# Altium project Buck-Boost-Converter.PrjPcb (part 2 of 2)

## Sheet GateDriver.SchDoc
size Letter; SheetNumber: 2; SheetTotal: 3
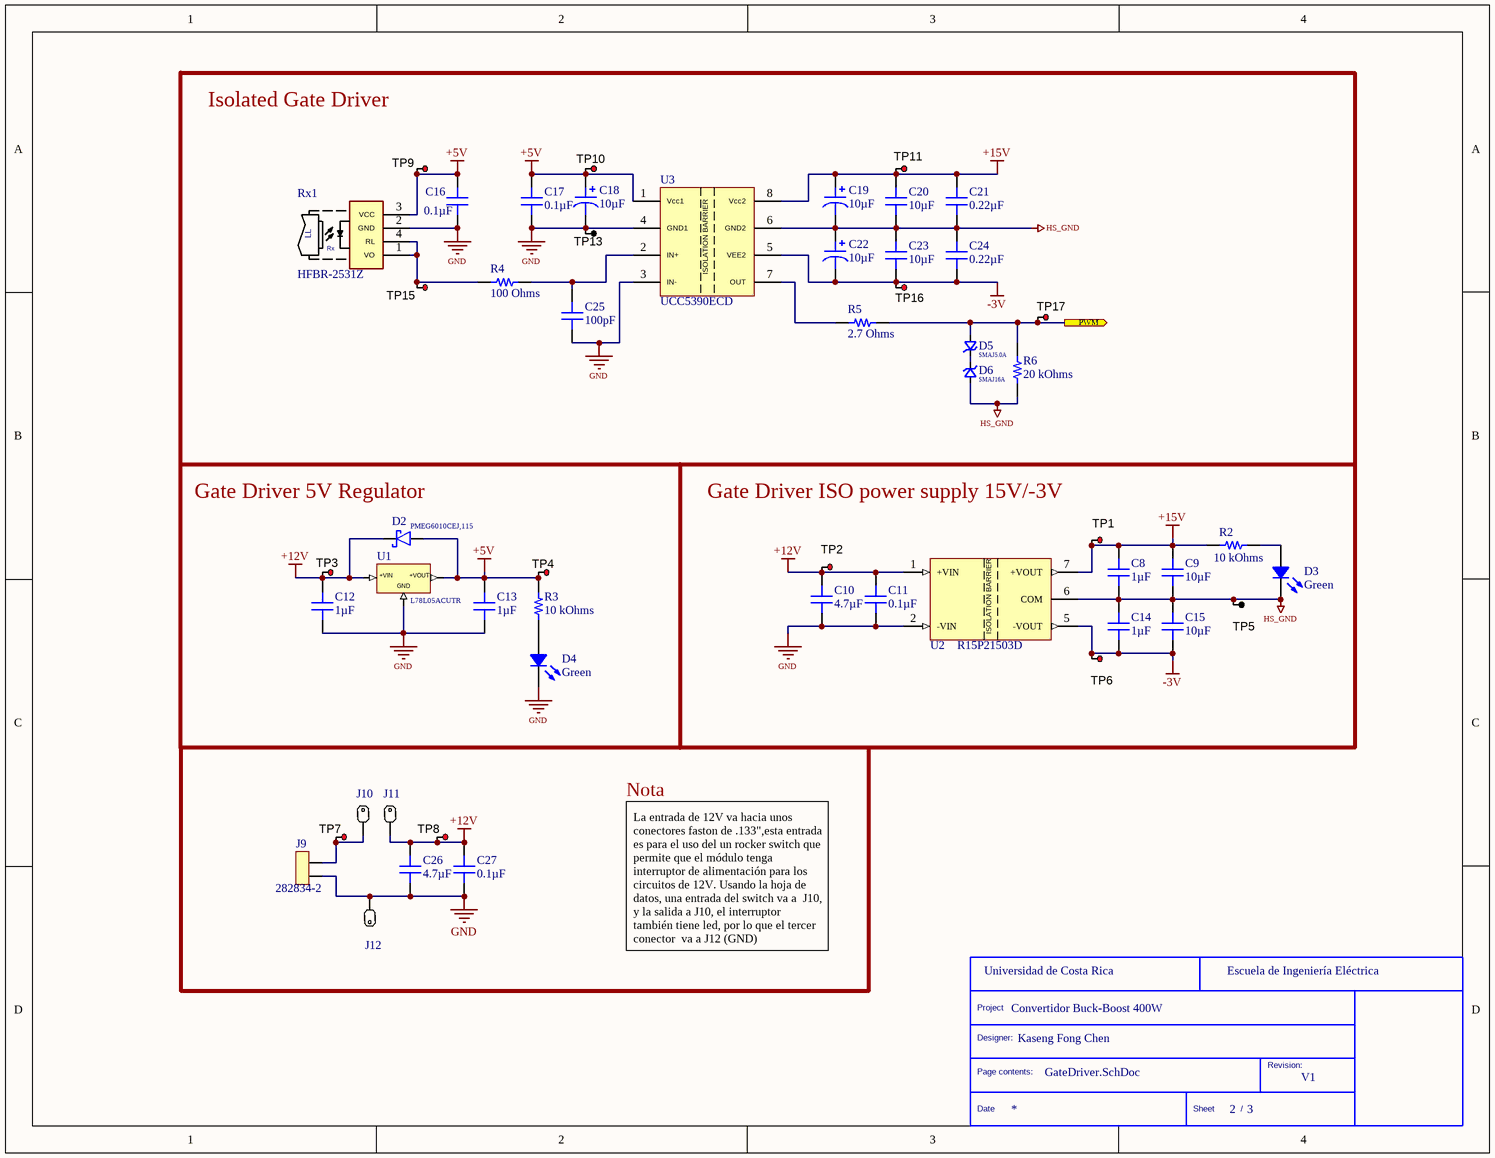
[diagram p1: GateDriver.SchDoc]

### Parts
(Parts that share a designator on the sheet are numbered #1, #2 ... from top to bottom, then left to right.)
*#2  TittleBlock  (value not drawn)  (graphical)
C8  1µF  [CAP 0603_1608]
C9  10µF  [CAP 1206_3216 - 1.8MM]
C10  4.7µF  [CAP 1206_3216 - 1.8MM]
C11  0.1µF  [CAP 0603_1608]
C12  1µF  [CAP 0603_1608]
C13  1µF  [CAP 0603_1608]
C14  1µF  [CAP 0603_1608]
C15  10µF  [CAP 1206_3216 - 1.8MM]
C16  0.1µF  [CAP 0603_1608]
C17  0.1µF  [CAP 0603_1608]
C18  10µF  [CAP POL 2917_7343]
C19  10µF  [CAP POL 2917_7343]
C20  10µF  [CAP 1210_3225 - 2.8MM]
C21  0.22µF  [CAP 0805_2012]
C22  10µF  [CAP POL 2917_7343]
C23  10µF  [CAP 1210_3225 - 2.8MM]
C24  0.22µF  [CAP 0805_2012]
C25  100pF  [CAP 0603_1608]
C26  4.7µF  [CAP 1206_3216 - 1.8MM]
C27  0.1µF  [CAP 0603_1608]
D2  PMEG6010CEJ,115  [SOD-323F]
D3  Green  [LED 0603_1608 GREEN]
D4  Green  [LED 0603_1608 GREEN]
D5  SMAJ5.0A  [DO214AC SMA]
D6  SMAJ16A  [DO214AC SMA]
J9  282834-2  [TE 282834-2]
J10  Faston .133  (value not drawn)
J11  Faston .133  (value not drawn)
J12  Faston .133  (value not drawn)
R2  10 kOhms  [RES 0603_1608]
R3  10 kOhms  [RES 0603_1608]
R4  100 Ohms  [RES 0603_1608]
R5  2.7 Ohms  [RES 1206_3216]
R6  20 kOhms  [RES 0603_1608]
Rx1  HFBR-2531Z  [HFBR-15X1V]
TP1  5010  [Keystone5010]  (value not drawn)
TP2  5010  [Keystone5010]  (value not drawn)
TP3  5010  [Keystone5010]  (value not drawn)
TP4  5010  [Keystone5010]  (value not drawn)
TP5  5011  [Keystone5011]  (value not drawn)
TP6  5010  [Keystone5010]  (value not drawn)
TP7  5010  [Keystone5010]  (value not drawn)
TP8  5010  [Keystone5010]  (value not drawn)
TP9  5010  [Keystone5010]  (value not drawn)
TP10  5010  [Keystone5010]  (value not drawn)
TP11  5010  [Keystone5010]  (value not drawn)
TP13  5011  [Keystone5011]  (value not drawn)
TP15  5010  [Keystone5010]  (value not drawn)
TP16  5010  [Keystone5010]  (value not drawn)
TP17  5010  [Keystone5010]  (value not drawn)
U1  L78L05ACUTR  [VREG_L78L12ABUTR]
U2  R15P21503D  [CONV_R15P21503D]
U3  UCC5390ECD  [SOIC127P599X175-8N]

### Ports
PWM (out)

### Nets
+5V: C13.2 C16.2 C17.2 C18.1 D2.2 R3.1 Rx1.3(VCC) TP4.1 TP9.1 TP10.1 U1.1(OUT) U3.1(Vcc1)
+12V: C10.2 C11.2 C12.2 C26.2 C27.2 D2.1 J11.1(P1) TP2.1 TP3.1 TP8.1 U1.3(IN) U2.1(+VIN)
+15V: C8.2 C9.2 C19.1 C20.1 C21.1 R2.1 TP1.1 TP11.1 U2.7(+VOUT) U3.8(Vcc2)
-3V: C14.1 C15.1 C22.2 C23.2 C24.2 TP6.1 TP16.1 U2.5(-VOUT) U3.5(VEE2)
GND: C10.1 C11.1 C12.1 C13.1 C16.1 C17.1 C18.2 C25.1 C26.1 C27.1 D4.2 J9.2 J12.1(P1) Rx1.2(GND) TP13.1 U1.2(GND) U2.2(-VIN) U3.3(IN-) U3.4(GND1)
HS_GND: C8.1 C9.1 C14.2 C15.2 C19.2 C20.2 C21.2 C22.1 C23.1 C24.1 D3.2 D6.2 R6.1 TP5.1 U2.6(COM) U3.6(GND2)
NetC25_2: C25.2 R4.2 U3.2(IN+)
NetD3_1: D3.1 R2.2
NetD4_1: D4.1 R3.2
NetD5_1: D5.1 D6.1
NetD5_2: D5.2 R5.2 R6.2 TP17.1 ; port PWM
NetJ9_1: J9.1 J10.1(P1) TP7.1
NetR4_1: R4.1 Rx1.1(VO) Rx1.4(RL) TP15.1
NetR5_1: R5.1 U3.7(OUT)

### Notes on the sheet
- Isolated Gate Driver
- (near D2) Gate Driver 5V Regulator
- Gate Driver ISO power supply 15V/-3V
- Nota
- La entrada de 12V va hacia unos conectores faston de .133",esta entrada es para el uso del un rocker switch que permite que el módulo tenga interruptor de alimentación para los circuitos de 12V. Usando la hoja de datos, una entrada del switch va a  J10, y la salida a J10, el interruptor también tiene led, por lo que el tercer conector  va a J12 (GND)
  .
- (in symbol HFBR-2531Z) LL; Rx
- (in symbol L78L05ACUTR) +VIN; +VOUT
- (in symbol R15P21503D) ISOLATION BARRIER
- (in symbol TittleBlock) Project; Designer:; Page contents:; Revision:; Date; Sheet; /
- (in symbol UCC5390ECD) ISOLATION BARRIER

### Library data of the parts
*#2 = TittleBlock: Standard Title block
C8 C14 = UMK107AB7105KA-T: CAP CER 1UF 50V X7R 0603; Manufacturer: Taiyo Yuden; Tolerance: ±10%; Part Number: UMK107AB7105KA-T; Value: 1µF; Applications: General Purpose; Capacitance: 1µF; ComponentLink1Description: Datasheet; ComponentLink1URL: https://www.yuden.co.jp/productdata/catalog/mlcc01_e.pdf; ComponentLink2Description: DigiKey Link; ComponentLink2URL: http://digikey.com/product-detail/en/taiyo-yuden/UMK107AB7105KA-T/587-3247-1-ND/3660107; Device Package: 0603 (1608 Metric); LastUpdated: 2/9/2020 01:03:17; Lifecycle Status: Active; Minimum Order: 1; Mounting Type: Surface Mount, MLCC; Operating Temperature: -55°C ~ 125°C; Package / Case: 0603 (1608 Metric); Packaging: TapeAndReel; PartId: 12796; Part Status: Active; Price: 0.05; Series: M; Size / Dimension: 0.063" L x 0.031" W (1.60mm x 0.80mm); Supplier 1: DigiKey; Supplier Part Number 1: 587-3247-1-ND; Temperature Coefficient: X7R; Thickness (Max): 0.037" (0.95mm); Voltage - Rated: 50V
C9 C15 = TMK316AB7106KL-T: CAP CER 10UF 25V X7R 1206; Manufacturer: Taiyo Yuden; Tolerance: ±10%; Part Number: TMK316AB7106KL-T; Value: 10µF; Applications: General Purpose; Capacitance: 10µF; ComponentLink1Description: Datasheet; ComponentLink1URL: https://www.yuden.co.jp/productdata/catalog/mlcc01_e.pdf; ComponentLink2Description: DigiKey Link; ComponentLink2URL: http://digikey.com/product-detail/en/taiyo-yuden/TMK316AB7106KL-T/587-3486-1-ND/4157519; Device Package: 1206 (3216 Metric); LastUpdated: 2/9/2020 01:05:40; Lifecycle Status: Active; Minimum Order: 1; Mounting Type: Surface Mount, MLCC; Operating Temperature: -55°C ~ 125°C; Package / Case: 1206 (3216 Metric); Packaging: TapeAndReel; PartId: 20052; Part Status: Active; Price: 0.08; Series: M; Size / Dimension: 0.126" L x 0.063" W (3.20mm x 1.60mm); Supplier 1: DigiKey; Supplier Part Number 1: 587-3486-1-ND; Temperature Coefficient: X7R; Thickness (Max): 0.071" (1.80mm); Voltage - Rated: 25V
C10 C26 = UMK316AB7475KL-T: CAP CER 4.7UF 50V X7R 1206; Manufacturer: Taiyo Yuden; Tolerance: ±10%; Part Number: UMK316AB7475KL-T; Value: 4.7µF; Applications: General Purpose; Capacitance: 4.7µF; ComponentLink1Description: Datasheet; ComponentLink1URL: https://www.yuden.co.jp/productdata/catalog/mlcc01_e.pdf; ComponentLink2Description: DigiKey Link; ComponentLink2URL: http://digikey.com/product-detail/en/taiyo-yuden/UMK316AB7475KL-T/587-2994-1-ND/2714187; Device Package: 1206 (3216 Metric); LastUpdated: 2/9/2020 01:05:40; Lifecycle Status: Active; Minimum Order: 1; Mounting Type: Surface Mount, MLCC; Operating Temperature: -55°C ~ 125°C; Package / Case: 1206 (3216 Metric); Packaging: TapeAndReel; PartId: 20094; Part Status: Active; Price: 0.08; Series: M; Size / Dimension: 0.126" L x 0.063" W (3.20mm x 1.60mm); Supplier 1: DigiKey; Supplier Part Number 1: 587-2994-1-ND; Temperature Coefficient: X7R; Thickness (Max): 0.071" (1.80mm); Voltage - Rated: 50V
C11 C16 C17 C27 = C0603C104M5RACTU: CAP CER 0.1UF 50V X7R 0603; Manufacturer: KEMET; Tolerance: ±20%; Part Number: C0603C104M5RACTU; Value: 0.1µF; Applications: Bypass, Decoupling; Capacitance: 0.1µF; ComponentLink1Description: Datasheet; ComponentLink1URL: https://api.kemet.com/component-edge/download/datasheet/C0603C104M5RACTU.pdf; ComponentLink2Description: DigiKey Link; ComponentLink2URL: http://digikey.com/product-detail/en/kemet/C0603C104M5RACTU/399-7845-1-ND/3471568; Device Package: 0603 (1608 Metric); LastUpdated: 2/9/2020 01:03:01; Lifecycle Status: Active; Minimum Order: 1; Mounting Type: Surface Mount, MLCC; Operating Temperature: -55°C ~ 125°C; Package / Case: 0603 (1608 Metric); Packaging: TapeAndReel; PartId: 17854; Part Status: Active; Price: 0.01; Series: SMD Comm X7R; Size / Dimension: 0.063" L x 0.031" W (1.60mm x 0.80mm); Supplier 1: DigiKey; Supplier Part Number 1: 399-7845-1-ND; Temperature Coefficient: X7R; Thickness (Max): 0.034" (0.87mm); Voltage - Rated: 50V
C12 = TMK107B7105KA-T: CAP CER 1UF 25V X7R 0603; Manufacturer: Taiyo Yuden; Tolerance: ±10%; Part Number: TMK107B7105KA-T; Value: 1µF; Applications: General Purpose; Capacitance: 1µF; ComponentLink1Description: Datasheet; ComponentLink1URL: https://www.yuden.co.jp/productdata/catalog/mlcc01_e.pdf; ComponentLink2Description: DigiKey Link; ComponentLink2URL: http://digikey.com/product-detail/en/taiyo-yuden/TMK107B7105KA-T/587-2984-1-ND/2714177; Device Package: 0603 (1608 Metric); LastUpdated: 2/9/2020 01:03:30; Lifecycle Status: Active; Minimum Order: 1; Mounting Type: Surface Mount, MLCC; Operating Temperature: -55°C ~ 125°C; Package / Case: 0603 (1608 Metric); Packaging: TapeAndReel; PartId: 5586; Part Status: Active; Price: 0.01; Series: M; Size / Dimension: 0.063" L x 0.031" W (1.60mm x 0.80mm); Supplier 1: DigiKey; Supplier Part Number 1: 587-2984-1-ND; Temperature Coefficient: X7R; Thickness (Max): 0.035" (0.90mm); Voltage - Rated: 25V
C13 = CC0603KRX7R7BB105: CAP CER 1UF 16V X7R 0603; Manufacturer: Yageo; Tolerance: ±10%; Part Number: CC0603KRX7R7BB105; Value: 1µF; Applications: General Purpose; Capacitance: 1µF; ComponentLink1Description: Datasheet; ComponentLink1URL: https://www.yageo.com/upload/media/product/productsearch/datasheet/mlcc/UPY-GPHC_X7R_6.3V-to-50V_18.pdf; ComponentLink2Description: DigiKey Link; ComponentLink2URL: http://digikey.com/product-detail/en/yageo/CC0603KRX7R7BB105/311-1446-1-ND/2833752; Device Package: 0603 (1608 Metric); LastUpdated: 2/9/2020 01:03:31; Lifecycle Status: Active; Minimum Order: 1; Mounting Type: Surface Mount, MLCC; Operating Temperature: -55°C ~ 125°C; Package / Case: 0603 (1608 Metric); Packaging: TapeAndReel; PartId: 5233; Part Status: Active; Price: 0.01; Series: CC; Size / Dimension: 0.063" L x 0.031" W (1.60mm x 0.80mm); Supplier 1: DigiKey; Supplier Part Number 1: 311-1446-1-ND; Temperature Coefficient: X7R; Thickness (Max): 0.035" (0.90mm); Voltage - Rated: 16V
C18 C19 C22 = T491D106K050AT: CAP TANT 10UF 10% 50V 2917; Manufacturer: KEMET; Manufacturer Size Code: D; ESR (Equivalent Series Resistance): 800mOhm; Lifetime @ Temp.: 2000 Hrs @ 125°C; Type: Molded; Part Number: T491D106K050AT; Value: 10µF; Capacitance: 10µF; ComponentLink1Description: Datasheet; ComponentLink1URL: https://api.kemet.com/component-edge/download/datasheet/T491D106K050AT.pdf; ComponentLink2Description: DigiKey Link; ComponentLink2URL: http://digikey.com/product-detail/en/kemet/T491D106K050AT/399-8361-1-ND/3472084; Device Package: 2917 (7343 Metric); Features: General Purpose; Height - Seated (Max): 0.122" (3.10mm); LastUpdated: 2/9/2020 01:16:12; Lifecycle Status: Active; Minimum Order: 1; Mounting Type: Surface Mount; Operating Temperature: -55°C ~ 125°C; Package / Case: 2917 (7343 Metric); Packaging: TapeAndReel; PartId: 3121; Part Status: Active; Price: 0.86; Series: T491; Size / Dimension: 0.287" L x 0.169" W (7.30mm x 4.30mm); Supplier 1: DigiKey; Supplier Part Number 1: 399-8361-1-ND; Tolerance: ±10%; Voltage - Rated: 50V
C20 C23 = UMK325C7106MM-T: CAP CER 10UF 50V X7S 1210; Manufacturer: Taiyo Yuden; Tolerance: ±20%; Part Number: UMK325C7106MM-T; Value: 10µF; Applications: General Purpose; Capacitance: 10µF; ComponentLink1Description: Datasheet; ComponentLink1URL: //media.digikey.com/pdf/Data%20Sheets/Taiyo%20Yuden%20PDFs%20URL%20links/UMK325C7106MM-T.pdf; ComponentLink2Description: DigiKey Link; ComponentLink2URL: http://digikey.com/product-detail/en/taiyo-yuden/UMK325C7106MM-T/587-1818-1-ND/1465288; Device Package: 1210 (3225 Metric); LastUpdated: 2/9/2020 01:10:51; Lifecycle Status: Active; Minimum Order: 1; Mounting Type: Surface Mount, MLCC; Operating Temperature: -55°C ~ 125°C; Package / Case: 1210 (3225 Metric); Packaging: TapeAndReel; PartId: 23921; Part Status: Active; Price: 0.21; Series: M; Size / Dimension: 0.126" L x 0.098" W (3.20mm x 2.50mm); Supplier 1: DigiKey; Supplier Part Number 1: 587-1818-1-ND; Temperature Coefficient: X7S; Thickness (Max): 0.106" (2.70mm); Voltage - Rated: 50V
C21 C24 = UMK212B7224KG-T: CAP CER 0.22UF 50V X7R 0805; Manufacturer: Taiyo Yuden; Tolerance: ±10%; Part Number: UMK212B7224KG-T; Value: 0.22µF; Applications: General Purpose; Capacitance: 0.22µF; ComponentLink1Description: Datasheet; ComponentLink1URL: https://www.yuden.co.jp/productdata/catalog/mlcc01_e.pdf; ComponentLink2Description: DigiKey Link; ComponentLink2URL: http://digikey.com/product-detail/en/taiyo-yuden/UMK212B7224KG-T/587-1287-1-ND/931064; Device Package: 0805 (2012 Metric); LastUpdated: 2/9/2020 01:04:19; Lifecycle Status: Active; Minimum Order: 1; Mounting Type: Surface Mount, MLCC; Operating Temperature: -55°C ~ 125°C; Package / Case: 0805 (2012 Metric); Packaging: TapeAndReel; PartId: 14273; Part Status: Active; Price: 0.03; Series: M; Size / Dimension: 0.079" L x 0.049" W (2.00mm x 1.25mm); Supplier 1: DigiKey; Supplier Part Number 1: 587-1287-1-ND; Temperature Coefficient: X7R; Thickness (Max): 0.053" (1.35mm); Voltage - Rated: 50V
C25 = 06035A101FAT2A: CAP CER 100PF 50V C0G/NP0 0603; Manufacturer: AVX Corporation; Temperature Coefficient: C0G, NP0; Tolerance: ±1%; Part Number: 06035A101FAT2A; Value: 100pF; Applications: General Purpose; Capacitance: 100pF; ComponentLink1Description: Datasheet; ComponentLink1URL: http://datasheets.avx.com/C0GNP0-Dielectric.pdf; ComponentLink2Description: DigiKey Link; ComponentLink2URL: http://digikey.com/product-detail/en/avx-corporation/06035A101FAT2A/478-6202-1-ND/2391401; Device Package: 0603 (1608 Metric); LastUpdated: 2/9/2020 01:03:14; Lifecycle Status: Active; Minimum Order: 1; Mounting Type: Surface Mount, MLCC; Operating Temperature: -55°C ~ 125°C; Package / Case: 0603 (1608 Metric); Packaging: TapeAndReel; PartId: 14099; Part Status: Active; Price: 0.03; Series: -; Size / Dimension: 0.063" L x 0.032" W (1.60mm x 0.81mm); Supplier 1: DigiKey; Supplier Part Number 1: 478-6202-1-ND; Thickness (Max): 0.035" (0.90mm); Voltage - Rated: 50V
D2 = PMEG6010CEJ,115: PMEG6010CEH; PMEG6010CEJ - 1 A very low VF MEGA Schottky barrier rectifiers; Manufacturer: Nexperia; =Value: 60V; Supplier 1: Digi-Key; Supplier Part Number 1: 1727-3882-1-ND; Manufacturer Part Number: PMEG6010CEJ,115; RoHS: Yes; Category: Rectifier Diodes; Stock 1: 105369; Pricing 1: 1=0,35000, 10=0,27200, 100=0,16340, 500=0,15128, 1000=0,10288 (USD); ComponentLink1URL: https://www.mouser.com/ds/2/302/PMEG6010CEH_PMEG6010CEJ-102368.pdf?src-supplier=Mouser; ComponentLink1Description: https://www.mouser.com/ds/2/302/PMEG6010CEH_PMEG6010CEJ-102368.pdf?src-supplier=Mouser; ComponentLink2URL: http://www.farnell.com/datasheets/109684.pdf?src-supplier=Farnell; ComponentLink2Description: http://www.farnell.com/datasheets/109684.pdf?src-supplier=Farnell; ComponentLink3URL: http://www.farnell.com/datasheets/109684.pdf?src-supplier=Newark; ComponentLink3Description: http://www.farnell.com/datasheets/109684.pdf?src-supplier=Newark; ComponentLink4URL: https://assets.nexperia.com/documents/data-sheet/PMEG6010CEH_PMEG6010CEJ.pdf?src-supplier=Digi-Key; ComponentLink4Description: https://assets.nexperia.com/documents/data-sheet/PMEG6010CEH_PMEG6010CEJ.pdf?src-supplier=Digi-Key
D3 D4 = 150060GS75000: LED GREEN CLEAR 0603 SMD; Manufacturer: Würth Elektronik; Configuration: Standard; Current - Test: 20mA; Lens Color: Colorless; Lens Size: 1.10mm x 0.70mm; Lens Style: Rectangle with Flat Top; Millicandela Rating: 430mcd; Viewing Angle: 140°; Voltage - Forward (Vf) (Typ): 3.2V; Wavelength - Dominant: 520nm; Wavelength - Peak: 515nm; Part Number: 150060GS75000; Color: Green; ComponentLink1Description: Datasheet; ComponentLink1URL: https://katalog.we-online.de/led/datasheet/150060GS75000.pdf; ComponentLink2Description: DigiKey Link; ComponentLink2URL: http://digikey.com/product-detail/en/w-rth-elektronik/150060GS75000/732-4971-1-ND/4489896; Device Package: 0603 (1608 Metric); Height (Max): 0.80mm; LastUpdated: 2/9/2020 01:20:41; Lens Transparency: Clear; Lifecycle Status: Active; Minimum Order: 1; Mounting Type: Surface Mount; Package / Case: 0603 (1608 Metric); Packaging: TapeAndReel; PartId: 686; Part Status: Active; Price: 0.10; Series: WL-SMCW; Size / Dimension: 1.60mm L x 0.80mm W; Supplier 1: DigiKey; Supplier Part Number 1: 732-4971-1-ND; Supplier Device Package: 0603; Value: Green
D5 = SMAJ5.0A: BOURNS - SMAJ5.0A - TVS Diode, SMAJ Series, Unidirectional, 5 V, 9.2 V, DO-214AC (SMA), 2 Pins; Max Power Dissipation: 400W; Number of Elements: 1; Max Surge Current: 40A; Reverse Breakdown Voltage: 6.4V; Breakdown Voltage: 7V; Reverse Standoff Voltage: 5V; Clamping Voltage: 9.2V; Test Current: 10mA; Peak Pulse Current: 43.5A; Element Configuration: Single; Leakage Current: 800uA; Operating Supply Voltage: 3.5V; Power Line Protection: No; Diode Type: ZENER; ESD Protection: Yes; Supplier 1: Digi-Key; Supplier Part Number 1: SMAJ5.0ABCT-ND; Manufacturer: Bourns; Manufacturer Part Number: SMAJ5.0A; RoHS: Yes; Category: TVS Diodes; Stock 1: 30981; Pricing 1: 1=0,49000, 10=0,34300, 100=0,17320, 500=0,14130, 1000=0,10483, 2000=0,08820 (USD); Mount: Surface Mount; Case/Package: DO-214AC; Number of Pins: 2; Min Operating Temperature: -55°C; Max Operating Temperature: 150°C; Packaging: Tape and Reel; Package Quantity: 1; Series: SMAJ; Polarity: Unidirectional; Direction: Unidirectional; Peak Pulse Power: 400W; Min Breakdown Voltage: 6.4V; Number of Channels: 1; Max Reverse Leakage Current: 800uA; Termination: SMD/SMT; Max Breakdown Voltage: 7V; Number of Unidirectional Channels: 1; Resistor Type: Zener; Length: 4.57mm; Width: 2.92mm; Height: 2.42mm; Radiation Hardening: No; RoHS Compliant: Yes; REACH SVHC: No SVHC; ComponentLink1URL: https://datasheet.ciiva.com/25624/0900766b8112213b-25624680.pdf?src-supplier=RSComponents; ComponentLink1Description: https://datasheet.ciiva.com/25624/0900766b8112213b-25624680.pdf?src-supplier=RSComponents; ComponentLink2URL: https://datasheet.ciiva.com/333/smaj-333521.pdf?src-supplier=Digi-Key; ComponentLink2Description: https://datasheet.ciiva.com/333/smaj-333521.pdf?src-supplier=Digi-Key; ComponentLink3URL: https://datasheet.ciiva.com/333/smaj-333522.pdf?src-supplier=Digi-Key; ComponentLink3Description: https://datasheet.ciiva.com/333/smaj-333522.pdf?src-supplier=Digi-Key; ComponentLink4URL: https://datasheet.ciiva.com/333/smaj-333523.pdf?src-supplier=Digi-Key; ComponentLink4Description: https://datasheet.ciiva.com/333/smaj-333523.pdf?src-supplier=Digi-Key; ComponentLink5URL: https://datasheet.ciiva.com/3021/smaj-3021400.pdf?src-supplier=Avnet; ComponentLink5Description: https://datasheet.ciiva.com/3021/smaj-3021400.pdf?src-supplier=Avnet; ComponentLink6URL: https://datasheet.ciiva.com/30169/smaj-30169929.pdf?src-supplier=Onlinecomponents.com; ComponentLink6Description: https://datasheet.ciiva.com/30169/smaj-30169929.pdf?src-supplier=Onlinecomponents.com; ComponentLink7URL: https://datasheet.ciiva.com/28409/1695388-28409916.pdf?src-supplier=Element14; ComponentLink7Description: https://datasheet.ciiva.com/28409/1695388-28409916.pdf?src-supplier=Element14
D6 = SMAJ16A: TVS DIODE 16VWM 26VC DO214AC; Manufacturer: Bourns; Clamping Voltage: 26V; Peak Pulse Power: 400W; Reverse Standoff Voltage: 16V; Peak Pulse Current: 15.3A; Polarity: Unidirectional; Test Current: 1mA; Min Breakdown Voltage: 17.8V; Max Surge Current: 40A; Breakdown Voltage: 19.7V; Operating Supply Voltage: 3.5V; Number of Channels: 1; Leakage Current: 5uA; Element Configuration: Single; Power Line Protection: No; Diode Type: ZENER; Supplier 1: Digi-Key; Supplier Part Number 1: SMAJ16ABCT-ND; Manufacturer Part Number: SMAJ16A; RoHS: Yes; Category: TVS Diodes; Stock 1: 14121; Pricing 1: 1=0,49000, 10=0,34400, 100=0,17360, 500=0,14160, 1000=0,10505, 2000=0,08838 (USD); Mount: Surface Mount; Case/Package: DO-214AC; Number of Pins: 2; Min Operating Temperature: -55°C; Max Operating Temperature: 150°C; Packaging: Tape and Reel; Package Quantity: 1; Direction: Unidirectional; Reverse Breakdown Voltage: 17.8V; Number of Elements: 1; Termination: SMD/SMT; Max Reverse Leakage Current: 5uA; Number of Unidirectional Channels: 1; Series: SMAJ; Max Power Dissipation: 400W; Resistor Type: Zener; Max Breakdown Voltage: 19.7V; Radiation Hardening: No; RoHS Compliant: Yes; REACH SVHC: No SVHC; ComponentLink1URL: https://datasheet.ciiva.com/3022/smaj-3022194.pdf?src-supplier=Avnet; ComponentLink1Description: https://datasheet.ciiva.com/3022/smaj-3022194.pdf?src-supplier=Avnet; ComponentLink2URL: https://datasheet.ciiva.com/3022/smaj-3022195.pdf?src-supplier=Avnet; ComponentLink2Description: https://datasheet.ciiva.com/3022/smaj-3022195.pdf?src-supplier=Avnet; ComponentLink3URL: https://datasheet.ciiva.com/8031/1695388-8031131.pdf?src-supplier=Element14; ComponentLink3Description: https://datasheet.ciiva.com/8031/1695388-8031131.pdf?src-supplier=Element14; ComponentLink4URL: https://datasheet.ciiva.com/28649/1695388-28649163.pdf?src-supplier=Element14; ComponentLink4Description: https://datasheet.ciiva.com/28649/1695388-28649163.pdf?src-supplier=Element14; ComponentLink5URL: https://datasheet.ciiva.com/333/smaj-333452.pdf?src-supplier=Digi-Key; ComponentLink5Description: https://datasheet.ciiva.com/333/smaj-333452.pdf?src-supplier=Digi-Key; ComponentLink6URL: https://datasheet.ciiva.com/333/smaj-333453.pdf?src-supplier=Digi-Key; ComponentLink6Description: https://datasheet.ciiva.com/333/smaj-333453.pdf?src-supplier=Digi-Key; ComponentLink7URL: https://datasheet.ciiva.com/17413/smaj-17413677.pdf?src-supplier=Avnet+Europe; ComponentLink7Description: https://datasheet.ciiva.com/17413/smaj-17413677.pdf?src-supplier=Avnet+Europe; ComponentLink8URL: https://datasheet.ciiva.com/333/smaj-333454.pdf?src-supplier=Digi-Key; ComponentLink8Description: https://datasheet.ciiva.com/333/smaj-333454.pdf?src-supplier=Digi-Key; ComponentLink9URL: https://datasheet.ciiva.com/16237/smaj-16237406.pdf?src-supplier=Onlinecomponents.com; ComponentLink9Description: https://datasheet.ciiva.com/16237/smaj-16237406.pdf?src-supplier=Onlinecomponents.com
J9 = 282834-2: TE CONNECTIVITY / BUCHANAN - 282834-2 - TERMINAL BLOCK, WIRE TO BRD, 2POS, 16AWG; Plating: Brass,Steel; Number of Contacts: 2; Voltage Rating: 150V; Number of Levels: 1; Current: 10A; Connector Type: Receptacle; Interlock: No (Without); Screwless Terminal Block: Yes (With); Gender: Male; Pitch: 2.54mm; Wire Gauge (Max): 30AWG; Thread Size: M1.6; Tail Length: 3.4mm; Approvals: UL; Supplier 1: Digi-Key; Supplier Part Number 1: A98333-ND; Manufacturer: TE Connectivity; Manufacturer Part Number: 282834-2; RoHS: Yes; Category: Terminal Blocks; Stock 1: 21575; Pricing 1: 1=1,27000, 10=0,89500, 25=0,83440, 50=0,75740, 100=0,75410, 250=0,63676, 500=0,60324, 1000=0,53622, 5000=0,50270 (USD); Mount: Through Hole; Housing Color: Green; Contact Plating: Tin; Contact Material: Brass; Color: Green; Housing Material: Polyamide; Material: Nylon; Min Operating Temperature: -40°C; Max Operating Temperature: 105°C; Number of Rows: 1; Termination: Solder; Orientation: Straight; Package Quantity: 300; Packaging: Bulk; Number of Positions: 2; Number of Positions Per Level: 2; Voltage: 150V; Max Supply Voltage (AC): 150V; Number of Circuits: 2; Screw Flange: No (Without); Side Stackable: Yes (With); Series: Buchanan; Max Voltage Rating (AC): 150V; Current Rating: 10A; Closed End: No (Without); Max Current Rating: 10A; Number of Poles: 2; Length: 5.54mm; Width: 6.5mm; Wire Gauge (Min): 30AWG; Depth: 6.5mm; Wire/Cable Gauge: 30AWG; Radiation Hardening: No; ELV: Compliant; Flammability Rating: UL94 V-0; RoHS Compliant: Yes; Lead Free: Lead Free; REACH SVHC: Unknown; ComponentLink1URL: https://datasheet.ciiva.com/11758/0900766b80e7dc96-11758675.pdf?src-supplier=RSComponents; ComponentLink1Description: https://datasheet.ciiva.com/11758/0900766b80e7dc96-11758675.pdf?src-supplier=RSComponents; ComponentLink2URL: https://datasheet.ciiva.com/16386/282834-2-16386363.pdf?src-supplier=Future+Electronics; ComponentLink2Description: https://datasheet.ciiva.com/16386/282834-2-16386363.pdf?src-supplier=Future+Electronics; ComponentLink3URL: https://datasheet.ciiva.com/14609/70086732-14609670.pdf?src-supplier=Allied+Electronics; ComponentLink3Description: https://datasheet.ciiva.com/14609/70086732-14609670.pdf?src-supplier=Allied+Electronics; ComponentLink4URL: https://datasheet.ciiva.com/15169/getdatasheetpartid-155864-15169558.pdf?src-supplier=Verical; ComponentLink4Description: https://datasheet.ciiva.com/15169/getdatasheetpartid-155864-15169558.pdf?src-supplier=Verical; ComponentLink5URL: https://datasheet.ciiva.com/16676/eng-cs-1308389-eurostyle-terminal-blocks-0607-16676126.pdf?src-supplier=Avnet+Europe; ComponentLink5Description: https://datasheet.ciiva.com/16676/eng-cs-1308389-eurostyle-terminal-blocks-0607-16676126.pdf?src-supplier=Avnet+Europe; ComponentLink6URL: https://datasheet.ciiva.com/30166/eng-cs-1308389-eurostyle-terminal-blocks-0607-30166974.pdf?src-supplier=Onlinecomponents.com; ComponentLink6Description: https://datasheet.ciiva.com/30166/eng-cs-1308389-eurostyle-terminal-blocks-0607-30166974.pdf?src-supplier=Onlinecomponents.com; ComponentLink7URL: https://datasheet.ciiva.com/3141/eng-cs-1308389-eurostyle-terminal-blocks-0607-3141115.pdf?src-supplier=Avnet; ComponentLink7Description: https://datasheet.ciiva.com/3141/eng-cs-1308389-eurostyle-terminal-blocks-0607-3141115.pdf?src-supplier=Avnet; ComponentLink8URL: https://datasheet.ciiva.com/823/eng-cd-282834-c1-823453.pdf?src-supplier=Digi-Key; ComponentLink8Description: https://datasheet.ciiva.com/823/eng-cd-282834-c1-823453.pdf?src-supplier=Digi-Key
J10-J12 = 1217133-1: CONN QC TAB 0.187 SOLDER; Manufacturer: TE Connectivity; Plating: Tin; Body Material: Brass; Insulation: Non-Insulated; Insulated Wire Support: Yes; Gender: Male; Outside Diameter: 1.32mm; Mating Tab Width: 4.75mm; Hole Diameter: 0.052inch; PCB Thickness: 0.062inch; Tab Width: 0.187inch; Tab Thickness: 0.032inch; Board Thickness: 1.57mm; Supplier 1: Digi-Key; Supplier Part Number 1: A100449CT-ND; Manufacturer Part Number: 1217133-1; RoHS: Yes; Category: Terminals; Stock 1: 9496; Pricing 1: 1=0,14000, 10=0,13300, 25=0,09920, 50=0,08500, 100=0,08210, 250=0,07076, 500=0,06794, 1000=0,05945, 2500=0,05379 (USD); Material: Brass; Body Plating: Tin; Contact Plating: Tin; Contact Material: Brass; Termination: Tab; Packaging: Tape and Reel; Package Quantity: 10000; Length: 12.45mm; Depth: 7.92mm; Radiation Hardening: No; Lead Free: Lead Free; ELV: Compliant; ComponentLink1URL: https://datasheet.ciiva.com/3144/eng-cs-82004-faston-pcb-tabs-receptacles-1012-3144672.pdf?src-supplier=Avnet; ComponentLink1Description: https://datasheet.ciiva.com/3144/eng-cs-82004-faston-pcb-tabs-receptacles-1012-3144672.pdf?src-supplier=Avnet; ComponentLink2URL: https://datasheet.ciiva.com/16301/eng-cs-82004-faston-pcb-tabs-receptacles-0311-16301555.pdf?src-supplier=Future+Electronics; ComponentLink2Description: https://datasheet.ciiva.com/16301/eng-cs-82004-faston-pcb-tabs-receptacles-0311-16301555.pdf?src-supplier=Future+Electronics; ComponentLink3URL: https://datasheet.ciiva.com/839/eng-cd-1217133-g-basefilename-839190.pdf?src-supplier=Digi-Key; ComponentLink3Description: https://datasheet.ciiva.com/839/eng-cd-1217133-g-basefilename-839190.pdf?src-supplier=Digi-Key; ComponentLink4URL: https://datasheet.ciiva.com/30183/eng-cat-82004-0706-042-052-30183301.pdf?src-supplier=Onlinecomponents.com; ComponentLink4Description: https://datasheet.ciiva.com/30183/eng-cat-82004-0706-042-052-30183301.pdf?src-supplier=Onlinecomponents.com; ComponentLink5URL: https://datasheet.ciiva.com/16647/eng-cs-82004-faston-pcb-tabs-receptacles-1012-16647017.pdf?src-supplier=Avnet+Europe; ComponentLink5Description: https://datasheet.ciiva.com/16647/eng-cs-82004-faston-pcb-tabs-receptacles-1012-16647017.pdf?src-supplier=Avnet+Europe; ComponentLink6URL: https://datasheet.ciiva.com/839/eng-cd-1217133-g-basefilename-839191.pdf?src-supplier=Digi-Key; ComponentLink6Description: https://datasheet.ciiva.com/839/eng-cd-1217133-g-basefilename-839191.pdf?src-supplier=Digi-Key
R2 R3 = RC0603FR-0710KL: RES SMD 10K OHM 1% 1/10W 0603; Manufacturer: Yageo; Power (Watts): 0.1W, 1/10W; Temperature Coefficient: ±100ppm/°C; Part Number: RC0603FR-0710KL; Value: 10 kOhms; ComponentLink1Description: Datasheet; ComponentLink1URL: https://www.yageo.com/upload/media/product/productsearch/datasheet/rchip/PYu-RC_Group_51_RoHS_L_10.pdf; ComponentLink2Description: DigiKey Link; ComponentLink2URL: http://digikey.com/product-detail/en/yageo/RC0603FR-0710KL/311-10.0KHRCT-ND/729827; Composition: Thick Film; Device Package: 0603 (1608 Metric); Features: Moisture Resistant; Height - Seated (Max): 0.022" (0.55mm); LastUpdated: 2/9/2020 01:09:45; Lifecycle Status: Active; Minimum Order: 1; Number of Terminations: 2; Operating Temperature: -55°C ~ 155°C; Package / Case: 0603 (1608 Metric); Packaging: CutTape; PartId: 22599; Part Status: Active; Price: 0.10; Resistance: 10 kOhms; Series: RC; Size / Dimension: 0.063" L x 0.031" W (1.60mm x 0.80mm); Supplier 1: DigiKey; Supplier Part Number 1: 311-10.0KHRCT-ND; Supplier Device Package: 0603; Tolerance: ±1%
R4 = CRCW0603100RFKEAC: RES SMD 100 OHM 1% 1/10W 0603; Manufacturer: Vishay Dale; Power (Watts): 0.1W, 1/10W; Temperature Coefficient: ±100ppm/°C; Part Number: CRCW0603100RFKEAC; Value: 100 Ohms; ComponentLink1Description: Datasheet; ComponentLink1URL: http://www.vishay.com/docs/28773/crcwce3.pdf; ComponentLink2Description: DigiKey Link; ComponentLink2URL: http://digikey.com/product-detail/en/vishay-dale/CRCW0603100RFKEAC/541-3951-1-ND/7928634; Composition: Thick Film; Device Package: 0603 (1608 Metric); Height - Seated (Max): 0.022" (0.55mm); LastUpdated: 2/9/2020 01:10:09; Lifecycle Status: Active; Minimum Order: 1; Number of Terminations: 2; Operating Temperature: -55°C ~ 155°C; Package / Case: 0603 (1608 Metric); Packaging: CutTape; PartId: 12546; Part Status: Active; Price: 0.10; Resistance: 100 Ohms; Series: CRCW-C; Supplier 1: DigiKey; Supplier Part Number 1: 541-3951-1-ND; Supplier Device Package: 0603; Tolerance: ±1%
R5 = CRCW12062R70FKEAHP: RES SMD 2.7 OHM 1% 3/4W 1206; Manufacturer: Vishay Dale; Power (Watts): 0.75W, 3/4W; Temperature Coefficient: ±100ppm/°C; Part Number: CRCW12062R70FKEAHP; ComponentLink1Description: Datasheet; ComponentLink1URL: http://www.vishay.com/docs/20043/crcwhpe3.pdf; ComponentLink2Description: DigiKey Link; ComponentLink2URL: http://digikey.com/product-detail/en/vishay-dale/CRCW12062R70FKEAHP/541-2.70UCT-ND/5326978; Composition: Thick Film; Device Package: 1206 (3216 Metric); Features: Automotive AEC-Q200, Pulse Withstanding; Height - Seated (Max): 0.024" (0.60mm); LastUpdated: 2/9/2020 01:12:48; Lifecycle Status: Active; Minimum Order: 1; Number of Terminations: 2; Operating Temperature: -55°C ~ 155°C; Package / Case: 1206 (3216 Metric); Packaging: TapeAndReel; PartId: 36112; Part Status: Active; Price: 0.06; Ratings: AEC-Q200; Resistance: 2.7 Ohms; Series: CRCW-HP; Size / Dimension: 0.122" L x 0.063" W (3.10mm x 1.60mm); Supplier 1: DigiKey; Supplier Part Number 1: 541-2.70UCT-ND; Supplier Device Package: 1206; Tolerance: ±1%; Value: 2.7 Ohms
R6 = RC0603FR-0720KL: RES SMD 20K OHM 1% 1/10W 0603; Manufacturer: Yageo; Power (Watts): 0.1W, 1/10W; Temperature Coefficient: ±100ppm/°C; Part Number: RC0603FR-0720KL; Value: 20 kOhms; ComponentLink1Description: Datasheet; ComponentLink1URL: https://www.yageo.com/upload/media/product/productsearch/datasheet/rchip/PYu-RC_Group_51_RoHS_L_10.pdf; ComponentLink2Description: DigiKey Link; ComponentLink2URL: http://digikey.com/product-detail/en/yageo/RC0603FR-0720KL/311-20.0KHRCT-ND/729987; Composition: Thick Film; Device Package: 0603 (1608 Metric); Features: Moisture Resistant; Height - Seated (Max): 0.022" (0.55mm); LastUpdated: 2/9/2020 01:09:40; Lifecycle Status: Active; Minimum Order: 1; Number of Terminations: 2; Operating Temperature: -55°C ~ 155°C; Package / Case: 0603 (1608 Metric); Packaging: CutTape; PartId: 23954; Part Status: Active; Price: 0.10; Resistance: 20 kOhms; Series: RC; Size / Dimension: 0.063" L x 0.031" W (1.60mm x 0.80mm); Supplier 1: DigiKey; Supplier Part Number 1: 311-20.0KHRCT-ND; Supplier Device Package: 0603; Tolerance: ±1%
Rx1 = HFBR-2531Z: RX Optical Fiber 5MBd 6-Pin; Manufacturer: Broadcom Avago; Wavelength: 660nm; Operating Supply Current: 10mA; Max Supply Voltage: 7V; Min Supply Voltage: -500mV; Output Current: 25mA; Data Rate: 115Kbps; Operating Supply Voltage: 5V; Max Power Dissipation: 40mW; Rise Time: 80ns; Fall Time: 40ns; Supplier 1: Digi-Key; Supplier Part Number 1: 516-2067-ND; Manufacturer Part Number: HFBR-2531Z; RoHS: Yes; Category: Fiber Optics; Stock 1: 6696; Pricing 1: 1=12,98000, 10=9,79400, 100=8,22730, 500=7,55568, 1000=7,39200 (USD); Mount: Through Hole; Number of Pins: 6; Weight: 0.021164oz; Min Operating Temperature: -40°C; Max Operating Temperature: 85°C; Package Quantity: 200; Max Output Current: 25mA; Packaging: Rail/Tube; Series: HFBR-2; Length: 18.3mm; Width: 12.2mm; Height: 18.8mm; Radiation Hardening: No; REACH SVHC: No SVHC; Lead Free: Lead Free; RoHS Compliant: Yes
TP1-TP4 TP6-TP11 TP15-TP17 = 5010: Test Point, Multipurpose, Red, TH; Manufacturer: Keystone; CompType: Test Point Loop; ContactFinish: Silver; SymbolVersion: 2008-04-04; PartNumber: 5010; PackageReference: Red Multipurpose Testpoint; RoHS: Y; MountType: TH; ComponentLink1Description: Datasheet URL; ComponentLink1URL: http://www.keyelco.com/userAssets/file/M60-2p60.pdf; Color: Red; Publisher: Texas Instruments; LatestRevisionDate: 2016-02-11; Supplier 1: Digi-Key; Supplier Part Number 1: 36-5010-ND; Supplier 2: Mouser; Supplier Part Number 2: 534-5010
TP5 TP13 = 5011: Test Point, Multipurpose, Black, TH; Manufacturer: Keystone; CompType: Test Point Loop; ContactFinish: Silver; SymbolVersion: 2008-04-04; PartNumber: 5011; PackageReference: Black Multipurpose Testpoint; RoHS: Y; MountType: TH; ComponentLink1Description: Datasheet URL; ComponentLink1URL: http://www.keyelco.com/userAssets/file/M60-2p60.pdf; Color: Black; Publisher: Texas Instruments; LatestRevisionDate: 2016-02-11; Supplier 1: Digi-Key; Supplier Part Number 1: 36-5011-ND; Supplier 2: Mouser; Supplier Part Number 2: 534-5011
U1 = L78L05ACUTR: Voltage regulator; linear, fixed; 5V; 0.1A; SOT89; SMD; 0÷125°C; Manufacturer: STMicroelectronics; Number of Outputs: 1; Max Input Voltage: 30V; Max Output Current: 100mA; Polarity: Positive; Quiescent Current: 6mA; Accuracy: 4%; Dropout Voltage: 1.7V; Min Input Voltage: 7V; Power Supply Rejection Ratio (PSRR): 49dB; Supplier 1: Digi-Key; Supplier Part Number 1: 497-1183-1-ND; Manufacturer Part Number: L78L05ACUTR; RoHS: Yes; Category: Voltage Regulators - Linear; Stock 1: 40018; Pricing 1: 1=0,53000, 10=0,43300, 25=0,39600, 100=0,26710, 250=0,22108, 500=0,20266, 1000=0,17380 (USD); Mount: Surface Mount; Case/Package: SOT-89; Number of Pins: 3; Weight: 0.004603oz; Contact Plating: Tin,Matte; Min Operating Temperature: 0°C; Max Operating Temperature: 125°C; Output Voltage: 5V; Output Type: Fixed; Package Quantity: 1; Packaging: Tape and Reel; Output Current: 100mA; Nominal Output Voltage: 5V; Number of Regulators: 1; Min Output Voltage: 5V; Output Voltage Accuracy: 4%; Series: -; Length: 4.6mm; Width: 2.6mm; Height: 1.6mm; Radiation Hardening: No; REACH SVHC: No SVHC; Lead Free: Lead Free; RoHS Compliant: Yes; ComponentLink1URL: https://datasheet.ciiva.com/2041/cd00000446-2041792.pdf?src-supplier=Digi-Key; ComponentLink1Description: https://datasheet.ciiva.com/2041/cd00000446-2041792.pdf?src-supplier=Digi-Key; ComponentLink2URL: https://datasheet.ciiva.com/1511/1868798-1511940.pdf?src-supplier=Element14; ComponentLink2Description: https://datasheet.ciiva.com/1511/1868798-1511940.pdf?src-supplier=Element14; ComponentLink3URL: https://datasheet.ciiva.com/7992/1868798-7992600.pdf?src-supplier=Element14; ComponentLink3Description: https://datasheet.ciiva.com/7992/1868798-7992600.pdf?src-supplier=Element14; ComponentLink4URL: https://datasheet.ciiva.com/16393/cd00000446-16393708.pdf?src-supplier=Future+Electronics; ComponentLink4Description: https://datasheet.ciiva.com/16393/cd00000446-16393708.pdf?src-supplier=Future+Electronics; ComponentLink5URL: https://datasheet.ciiva.com/22710/1868798-22710940.pdf?src-supplier=Element14; ComponentLink5Description: https://datasheet.ciiva.com/22710/1868798-22710940.pdf?src-supplier=Element14; ComponentLink6URL: https://datasheet.ciiva.com/4882/cd00000446-355303-4882429.pdf?src-supplier=Mouser; ComponentLink6Description: https://datasheet.ciiva.com/4882/cd00000446-355303-4882429.pdf?src-supplier=Mouser; ComponentLink7URL: https://datasheet.ciiva.com/2041/cd00000446-2041790.pdf?src-supplier=Digi-Key; ComponentLink7Description: https://datasheet.ciiva.com/2041/cd00000446-2041790.pdf?src-supplier=Digi-Key; ComponentLink8URL: https://datasheet.ciiva.com/2041/cd00000446-2041791.pdf?src-supplier=Digi-Key; ComponentLink8Description: https://datasheet.ciiva.com/2041/cd00000446-2041791.pdf?src-supplier=Digi-Key
U2 = R15P21503D: 2W DC/DC-Converter 'ECONOLINE' SIP7 6.4kV unreg; V. In: 15; V. Out: +15/-03; mA. Out: +93/-185; Manufacturer: Recom; Max Output Voltage: 15V; Supplier 1: Digi-Key; Supplier Part Number 1: 945-3070-5-ND; Manufacturer Part Number: R15P21503D; RoHS: Yes; Category: Voltage Regulators - Switching; Stock 1: 1614; Pricing 1: 1=8,47000, 5=8,31800, 10=8,25500, 25=8,12800, 50=7,87400, 100=7,26000, 250=6,98500, 500=6,85800 (USD); Weight: 4.3g; Length: 19.5mm; Width: 9.8mm; Height: 12.5mm; RoHS Compliant: Yes; ComponentLink1URL: https://www.recom-power.com/pdf/Econoline/RxxP2xxyy.pdf?src-supplier=Digi-Key; ComponentLink1Description: https://www.recom-power.com/pdf/Econoline/RxxP2xxyy.pdf?src-supplier=Digi-Key
U3 = UCC5390ECD: 10-A/10-A, 3-k/5-kVRMS single-channel isolated gate driver with 12-V UVLO, bipolar supply 8-SOIC -40 to 125; Manufacturer: Texas Instruments; Working Voltage: 990V; Number of Channels: 1; Propagation Delay: 100ns; Pulse Width Distortion (PWD): 20ns; High Level Output Current: 10A; Approvals: CSA,VDE,UR,CQC; Supplier 1: Digi-Key; Supplier Part Number 1: 296-48101-ND; Manufacturer Part Number: UCC5390ECD; RoHS: Yes; Category: Integrated Circuits (ICs); Stock 1: 1559; Pricing 1: 1=2,81000, 10=2,52800, 25=2,38480, 100=1,90800, 250=1,66952, 500=1,62180, 1000=1,28790, 2500=1,26000 (USD); Mount: Surface Mount; Case/Package: SOIC; Min Operating Temperature: -40°C; Max Operating Temperature: 125°C; Low Level Output Current: 10A; Packaging: Rail/Tube; RoHS Compliant: Yes; ComponentLink1URL: http://www.ti.com/lit/ds/symlink/ucc5390.pdf?src-supplier=Digi-Key; ComponentLink1Description: http://www.ti.com/lit/ds/symlink/ucc5390.pdf?src-supplier=Digi-Key

## Sheet Hardware.SchDoc
size Letter; SheetNumber: 3; SheetTotal: 3
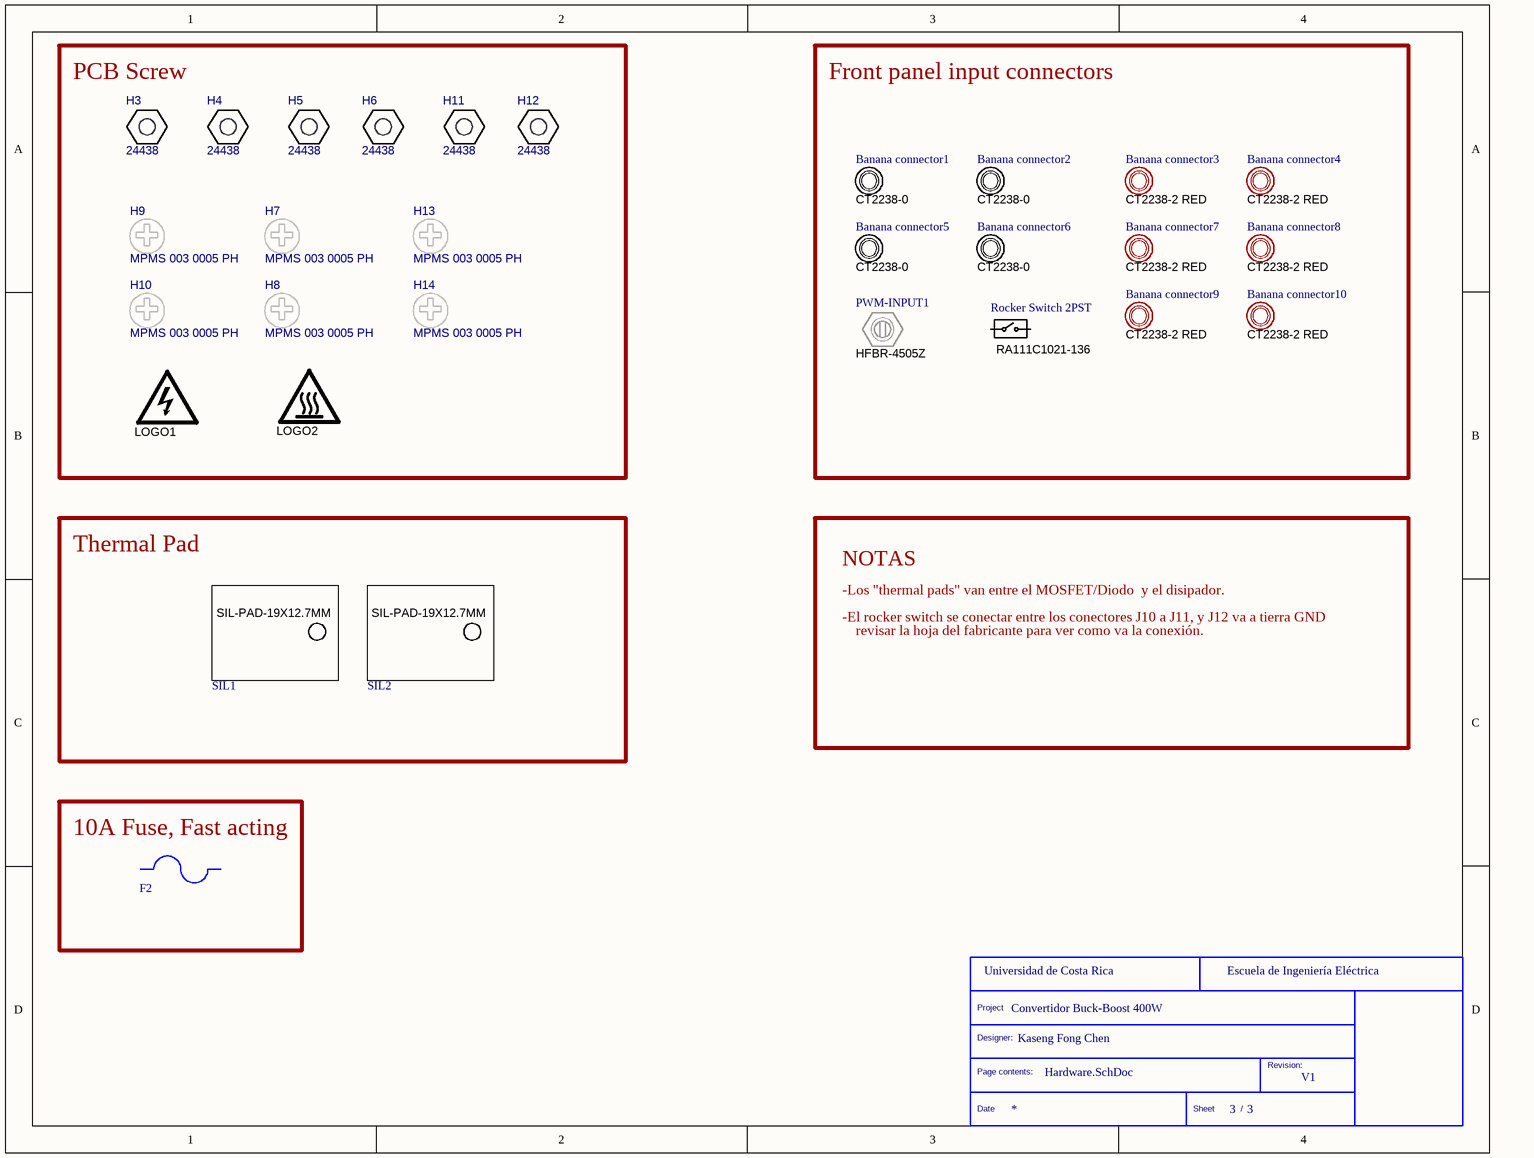
[diagram p2: Hardware.SchDoc]

### Parts
(Parts that share a designator on the sheet are numbered #1, #2 ... from top to bottom, then left to right.)
*#3  TittleBlock  (value not drawn)  (graphical)
Banana_connector1  CT2238-0  (mechanical)
Banana_connector2  CT2238-0  (mechanical)
Banana_connector3  CT2238-2 RED  (mechanical)
Banana_connector4  CT2238-2 RED  (mechanical)
Banana_connector5  CT2238-0  (mechanical)
Banana_connector6  CT2238-0  (mechanical)
Banana_connector7  CT2238-2 RED  (mechanical)
Banana_connector8  CT2238-2 RED  (mechanical)
Banana_connector9  CT2238-2 RED  (mechanical)
Banana_connector10  CT2238-2 RED  (mechanical)
F2  5SF 10-R  (value not drawn)  (mechanical)
H3  24438  [Keystone24438]
H4  24438  [Keystone24438]
H5  24438  [Keystone24438]
H6  24438  [Keystone24438]
H7  MPMS 003 0005 PH  [BuildingFastener_MPMS_003_0005_PH]
H8  MPMS 003 0005 PH  [BuildingFastener_MPMS_003_0005_PH]
H9  MPMS 003 0005 PH  [BuildingFastener_MPMS_003_0005_PH]
H10  MPMS 003 0005 PH  [BuildingFastener_MPMS_003_0005_PH]
H11  24438  [Keystone24438]
H12  24438  [Keystone24438]
H13  MPMS 003 0005 PH  [BuildingFastener_MPMS_003_0005_PH]
H14  MPMS 003 0005 PH  [BuildingFastener_MPMS_003_0005_PH]
LOGO1  DANGER HIGH VOLTAGE  [IEC_HighVoltage_Medium]  (value not drawn)  (no BOM)
LOGO2  CAUTION HOT SURFACE  [IEC_HotSurface_Medium]  (value not drawn)  (no BOM)
PWM-INPUT1  HFBR-4505Z  (mechanical)
Rocker_Switch_2PST  RA111C1021-136  (mechanical)
SIL1  SP900S-0.009-AC-58  [SIL-PAD_19x12.7mm]  (value not drawn)  (mechanical)
SIL2  SP900S-0.009-AC-58  [SIL-PAD_19x12.7mm]  (value not drawn)  (mechanical)

### Blocks framed on the sheet
PCB Screw: H3-H14 LOGO1 LOGO2
Front panel input connectors: Banana_connector1-Banana_connector10 PWM-INPUT1 Rocker_Switch_2PST
Thermal Pad: SIL1 SIL2
10A Fuse, Fast acting: F2

### Notes on the sheet
- NOTAS
- -Los "thermal pads" van entre el MOSFET/Diodo  y el disipador.
- -El rocker switch se conectar entre los conectores J10 a J11, y J12 va a tierra GND
- revisar la hoja del fabricante para ver como va la conexión.
- (in symbol SP900S-0.009-AC-58) SIL-PAD-19X12.7MM
- (in symbol TittleBlock) Project; Designer:; Page contents:; Revision:; Date; Sheet; /

### Library data of the parts
*#3 = TittleBlock: Standard Title block
Banana_connector1 Banana_connector2 Banana_connector5 Banana_connector6 = CT2238-0: Cable Assembly 4MM Safety Jack, Panel W/.25 Fast on Terminal Black; Manufacturer: Cal Test Electronics; Supplier 1: Digi-Key; Supplier Part Number 1: BKCT2238-0-ND; Manufacturer Part Number: CT2238-0; RoHS: No; Stock 1: 1448; Pricing 1: 1=2,00000 (USD)
Banana_connector3 Banana_connector4 Banana_connector7-Banana_connector10 = CT2238-2: Cable Assembly 4MM Safety Jack, Panel W/.25 Fast on Terminal Red; Manufacturer: Cal Test Electronics; Manufacturer Part Number: CT2238-0; Supplier 1: Digi-Key; Supplier Part Number 1: BKCT2238-0-ND; RoHS: No; Stock 1: 1448; Pricing 1: 1=2,00000 (USD)
F2 = 5SF 10-R: Fuse, 10 A, 250 VAC, N/A; Manufacturer: Bel Fuse; SymbolCreator: a0412235; VAC_V: 250; Interrupt_AC: 100; Irating_A: 10; Rtyp_Ohm: 0.006; MeltingTyp: 163; SymbolVersion: 2013-06-05; PartNumber: 5SF 10-R; MountType: N/A; CompType: Fuse; RoHS: Y; Published: 2009-03-05; Publisher: Texas Instruments; LatestRevisionDate: 2016-05-23; ComponentLink1Description: Datasheet URL; ComponentLink1URL: http://belfuse.com/pdfs/5SF.pdf; Supplier 1: Digi-Key; Supplier Part Number 1: 507-1235-ND; Supplier 2: Mouser; Supplier Part Number 2: 530-5SF10-R
H3-H6 H11 H12 = CMP-0003640-1: Standoff, Hex,25mm Length, M3, Aluminum; Manufacturer: Keystone; CompType: Hardware; ComponentLink1URL: http://www.keyelco.com/userAssets/file/M60-2p72.pdf; Key: 24438; Publisher: Texas Instruments; Supplier Part Number 2: 534-24438; Supplier 1: Digi-Key; PackageReference: Standoff M3; LatestRevisionDate: 2017-03-09; RoHS: Y; Supplier Part Number 1: 36-24438-ND; MountType: TH; Supplier 2: Mouser; PartNumber: 24438; ComponentLink1Description: Datasheet Link
H7-H10 H13 H14 = CMP-0003646-1: MACHINE SCREW PAN PHILLIPS M3 5mm; Manufacturer: B&F Fastener Supply; CompType: Hardware; ComponentLink1URL: http://www.fasnetdirect.com/refguide/MetD7985a.pdf; Key: MPMS 003 0005 PH; Publisher: Texas Instruments; Supplier 1: Digi-Key; PackageReference: Screw M3 Phillips head; LatestRevisionDate: 2017-03-09; ClassName: Screw; RoHS: Y; Supplier Part Number 1: H742-ND; MountType: N/A; PartNumber: MPMS 003 0005 PH; ComponentLink1Description: Datasheet Link
LOGO1 = CMP-0074835-1: IEC 61010-1 High Voltage Warning; SymbolCreator: a0412235; Lib Reference: IEC_HighVoltage; SymbolVersion: 2011-08-22; Published: 2009-03-03; Publisher: Texas Instruments; LatestRevisionDate: 2017-07-06; PartNumber: DANGER HIGH VOLTAGE; Library Reference: IEC_HighVoltage
LOGO2 = CMP-0074837-1: IEC 61010-1 Hot Surface Warning; SymbolCreator: a0412235; Lib Reference: IEC_HotSurface; SymbolVersion: 2011-08-22; Published: 2009-03-03; Publisher: Texas Instruments; LatestRevisionDate: 2017-07-06; PartNumber: CAUTION HOT SURFACE; Library Reference: IEC_HotSurface
PWM-INPUT1 = HFBR-4505Z: Conn POF Adapter Simplex F/F ST Panel Mount; Manufacturer: Broadcom Avago; Body Material: Plastic; Simplex/Duplex: Duplex; Gender: Male; Mode: Singlemode; Supplier 1: Digi-Key; Supplier Part Number 1: 516-1748-ND; Manufacturer Part Number: HFBR-4505Z; RoHS: Yes; Category: Fiber Optics; Stock 1: 6533; Pricing 1: 1=1,88000, 10=1,19200, 100=0,88240, 500=0,81090, 1000=0,66780, 2000=0,63441, 5000=0,63000 (USD); Mount: Panel,Bulkhead; Color: Grey; Housing Color: Grey; Material: Plastic; Housing Material: Plastic; Min Operating Temperature: -40°C; Max Operating Temperature: 85°C; Package Quantity: 500; Packaging: Bulk; Orientation: Straight; Series: -; Port Type: SIMPLEX; Length: 30mm; Depth: 11mm; REACH SVHC: No SVHC; Lead Free: Lead Free; RoHS Compliant: Yes
Rocker_Switch_2PST = RA111C1021-136: Illuminated Rocker Switches 16A 125VAC 4.8mm Tab Off-On; Manufacturer: E-Switch; Illumination Type: LED,Neon; Illumination Color: Green; Voltage Rating (AC): 125V; Throw Configuration: SPST; Electrical Life: 10000Cycles; Switch Function: On-Off; Supplier 1: Digi-Key; Supplier Part Number 1: RA111C1021-136-ND; Manufacturer Part Number: RA111C1021-136; RoHS: Yes; Category: Rocker Switches; Stock 1: 790; Pricing 1: 1=1,18000, 10=1,05800, 25=1,00160, 50=0,95480, 100=0,90790, 250=0,87048, 500=0,81900, 1000=0,77220 (USD); Mount: Panel,Snap in; Color: Black; Contact Plating: Silver; Housing Material: Polyamide; Min Operating Temperature: -20°C; Max Operating Temperature: 55°C; Package Quantity: 1; Current Rating: 16A; Packaging: Bulk; Termination: Quick Connect; Series: RA1, LAMB; RoHS Compliant: Yes; ComponentLink1URL: https://datasheet.ciiva.com/6470/ra1-6470604.pdf?src-supplier=Digi-Key; ComponentLink1Description: https://datasheet.ciiva.com/6470/ra1-6470604.pdf?src-supplier=Digi-Key
SIL1 SIL2 = SP900S-0.009-AC-58: Silcon Thermal Pad; Manufacturer: Bergquist Company; SymbolCreator: a0411947; SymbolVersion: 2016-05-23; ClassName: Thermal; CompType: Thermal Pad; PartNumber: SP900S-0.009-AC-58; RoHS: Y; PackageReference: 19x12.7 mm; MountType: N/A; ComponentLink1Description: Datasheet Link; ComponentLink1URL: http://www.bergquistcompany.com/pdfs/dataSheets/PDS_QP_3_12.08_E.pdf; Publisher: Texas Instruments; LatestRevisionDate: 2016-05-23; Supplier 1: Digi-Key; Supplier Part Number 1: BER183-ND; Supplier 2: Mouser; Supplier Part Number 2: 951-SP900S-009-AC-58

## Nets that join several sheets
HS_GND: PowerCard (Q1.3), GateDriver (16 pins)
NetD5_2: PowerCard (Q1.4), GateDriver (D5.2 R5.2 R6.2 TP17.1)